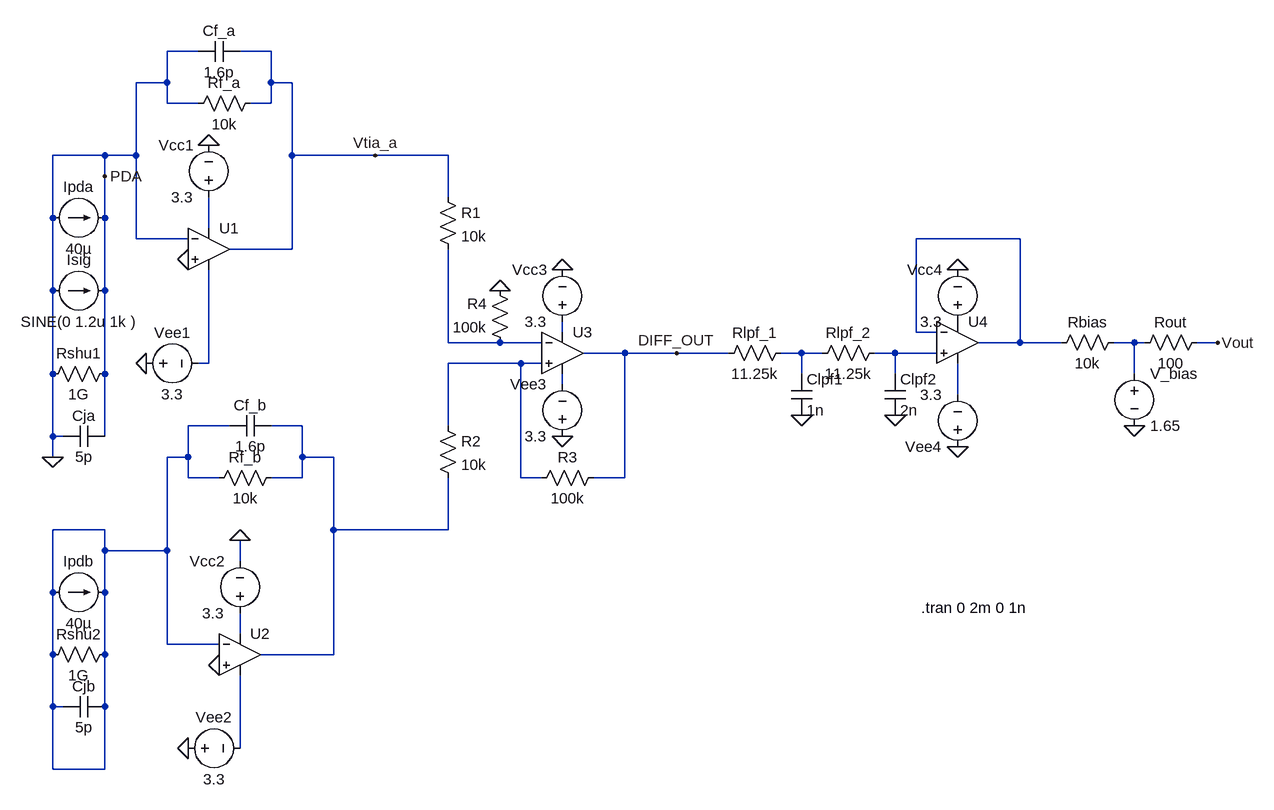
[diagram p0: schematic analog chain (1).asc]
analog chain (1).asc, the LTspice schematic file:
Version 4
SHEET 1 2132 1044
WIRE 496 -208 448 -208
WIRE 608 -208 560 -208
WIRE 448 -160 448 -208
WIRE 448 -160 400 -160
WIRE 608 -160 608 -208
WIRE 640 -160 608 -160
WIRE 448 -128 448 -160
WIRE 496 -128 448 -128
WIRE 608 -128 608 -160
WIRE 608 -128 576 -128
WIRE 352 -48 272 -48
WIRE 400 -48 400 -160
WIRE 400 -48 352 -48
WIRE 640 -48 640 -160
WIRE 768 -48 640 -48
WIRE 880 -48 768 -48
WIRE 352 -16 352 -48
WIRE 880 16 880 -48
WIRE 272 48 272 -48
WIRE 352 48 352 -16
WIRE 512 64 512 16
WIRE 400 80 400 -48
WIRE 480 80 400 80
WIRE 1760 80 1600 80
WIRE 640 96 640 -48
WIRE 640 96 544 96
WIRE 272 160 272 48
WIRE 352 160 352 48
WIRE 1056 224 1056 208
WIRE 1600 224 1600 80
WIRE 1632 224 1600 224
WIRE 880 240 880 96
WIRE 960 240 880 240
WIRE 1024 240 960 240
WIRE 1760 240 1760 80
WIRE 1760 240 1696 240
WIRE 1824 240 1760 240
WIRE 1936 240 1904 240
WIRE 1952 240 1936 240
WIRE 2064 240 2032 240
WIRE 1152 256 1088 256
WIRE 1232 256 1152 256
WIRE 1312 256 1232 256
WIRE 1424 256 1392 256
WIRE 1456 256 1424 256
WIRE 1568 256 1536 256
WIRE 1632 256 1568 256
WIRE 512 272 512 128
WIRE 512 272 496 272
WIRE 992 272 880 272
WIRE 1024 272 992 272
WIRE 272 288 272 160
WIRE 352 288 352 160
WIRE 1424 288 1424 256
WIRE 1568 288 1568 256
WIRE 1936 288 1936 240
WIRE 1056 304 1056 288
WIRE 1664 320 1664 272
WIRE 544 368 480 368
WIRE 656 368 608 368
WIRE 880 368 880 272
WIRE 272 384 272 288
WIRE 288 384 272 384
WIRE 352 384 352 288
WIRE 272 416 272 384
WIRE 480 416 480 368
WIRE 480 416 448 416
WIRE 656 416 656 368
WIRE 704 416 656 416
WIRE 480 448 480 416
WIRE 528 448 480 448
WIRE 656 448 656 416
WIRE 656 448 608 448
WIRE 992 448 992 272
WIRE 1024 448 992 448
WIRE 1152 448 1152 256
WIRE 1152 448 1104 448
WIRE 352 528 272 528
WIRE 704 528 704 416
WIRE 880 528 880 448
WIRE 880 528 704 528
WIRE 352 560 352 528
WIRE 448 560 448 416
WIRE 448 560 352 560
WIRE 560 576 560 544
WIRE 272 624 272 528
WIRE 352 624 352 560
WIRE 560 688 560 656
WIRE 448 704 448 560
WIRE 528 704 448 704
WIRE 272 720 272 624
WIRE 352 720 352 624
WIRE 704 720 704 528
WIRE 704 720 592 720
WIRE 272 800 272 720
WIRE 288 800 272 800
WIRE 352 800 352 720
WIRE 560 864 560 752
WIRE 272 896 272 800
WIRE 352 896 352 800
WIRE 352 896 272 896
FLAG 352 -16 PDA
FLAG 512 -64 0
FLAG 480 112 0
FLAG 416 272 0
FLAG 272 416 0
FLAG 480 864 0
FLAG 528 736 0
FLAG 560 544 0
FLAG 1056 384 0
FLAG 1056 128 0
FLAG 960 160 0
FLAG 1232 256 DIFF_OUT
FLAG 1424 352 0
FLAG 1568 352 0
FLAG 1664 128 0
FLAG 1664 400 0
FLAG 1936 368 0
FLAG 2064 240 Vout
FLAG 768 -48 Vtia_a
SYMBOL voltage 400 272 R270
WINDOW 0 32 56 VTop 2
WINDOW 3 -32 56 VBottom 2
SYMATTR InstName Vee1
SYMATTR Value 3.3
SYMBOL current 272 48 R270
WINDOW 0 32 40 VTop 2
WINDOW 3 -32 40 VBottom 2
SYMATTR InstName Ipda
SYMATTR Value 40µ
SYMBOL current 272 160 R270
WINDOW 0 32 40 VTop 2
WINDOW 3 -32 40 VBottom 2
SYMATTR InstName Isig
SYMATTR Value SINE(0 1.2u 1k )
SYMBOL cap 352 368 R90
WINDOW 0 0 32 VBottom 2
WINDOW 3 32 32 VTop 2
SYMATTR InstName Cja
SYMATTR Value 5p
SYMBOL res 368 272 R90
WINDOW 0 0 56 VBottom 2
WINDOW 3 32 56 VTop 2
SYMATTR InstName Rshu1
SYMATTR Value 1G
SYMBOL voltage 512 32 R180
WINDOW 0 24 96 Left 2
WINDOW 3 24 16 Left 2
SYMATTR InstName Vcc1
SYMATTR Value 3.3
SYMBOL cap 560 -224 R90
WINDOW 0 0 32 VBottom 2
WINDOW 3 32 32 VTop 2
SYMATTR InstName Cf_a
SYMATTR Value 1.6p
SYMBOL res 592 -144 R90
WINDOW 0 0 56 VBottom 2
WINDOW 3 32 56 VTop 2
SYMATTR InstName Rf_a
SYMATTR Value 10k
SYMBOL current 272 624 R270
WINDOW 0 32 40 VTop 2
WINDOW 3 -32 40 VBottom 2
SYMATTR InstName Ipdb
SYMATTR Value 40µ
SYMBOL res 368 704 R90
WINDOW 0 0 56 VBottom 2
WINDOW 3 32 56 VTop 2
SYMATTR InstName Rshu2
SYMATTR Value 1G
SYMBOL cap 352 784 R90
WINDOW 0 0 32 VBottom 2
WINDOW 3 32 32 VTop 2
SYMATTR InstName Cjb
SYMATTR Value 5p
SYMBOL voltage 464 864 R270
WINDOW 0 32 56 VTop 2
WINDOW 3 -32 56 VBottom 2
SYMATTR InstName Vee2
SYMATTR Value 3.3
SYMBOL voltage 560 672 R180
WINDOW 0 24 96 Left 2
WINDOW 3 24 16 Left 2
SYMATTR InstName Vcc2
SYMATTR Value 3.3
SYMBOL res 624 432 R90
WINDOW 0 0 56 VBottom 2
WINDOW 3 32 56 VTop 2
SYMATTR InstName Rf_b
SYMATTR Value 10k
SYMBOL cap 608 352 R90
WINDOW 0 0 32 VBottom 2
WINDOW 3 32 32 VTop 2
SYMATTR InstName Cf_b
SYMATTR Value 1.6p
SYMBOL OpAmps/UniversalOpAmp2 1056 256 R0
SYMATTR InstName U3
SYMBOL OpAmps/UniversalOpAmp2 512 96 R0
SYMATTR InstName U1
SYMBOL OpAmps/UniversalOpAmp2 560 720 R0
SYMATTR InstName U2
SYMBOL res 864 0 R0
SYMATTR InstName R1
SYMATTR Value 10k
SYMBOL res 864 352 R0
SYMATTR InstName R2
SYMATTR Value 10k
SYMBOL voltage 1056 400 R180
WINDOW 0 24 96 Left 2
WINDOW 3 24 16 Left 2
SYMATTR InstName Vee3
SYMATTR Value 3.3
SYMBOL voltage 1056 224 R180
WINDOW 0 24 96 Left 2
WINDOW 3 24 16 Left 2
SYMATTR InstName Vcc3
SYMATTR Value 3.3
SYMBOL res 1120 432 R90
WINDOW 0 0 56 VBottom 2
WINDOW 3 32 56 VTop 2
SYMATTR InstName R3
SYMATTR Value 100k
SYMBOL res 976 256 R180
WINDOW 0 36 76 Left 2
WINDOW 3 36 40 Left 2
SYMATTR InstName R4
SYMATTR Value 100k
SYMBOL OpAmps/UniversalOpAmp2 1664 240 R0
SYMATTR InstName U4
SYMBOL res 1408 240 R90
WINDOW 0 0 56 VBottom 2
WINDOW 3 32 56 VTop 2
SYMATTR InstName Rlpf_1
SYMATTR Value 11.25k
SYMBOL res 1552 240 R90
WINDOW 0 0 56 VBottom 2
WINDOW 3 32 56 VTop 2
SYMATTR InstName Rlpf_2
SYMATTR Value 11.25k
SYMBOL cap 1408 288 R0
SYMATTR InstName Clpf1
SYMATTR Value 1n
SYMBOL cap 1552 288 R0
SYMATTR InstName Clpf2
SYMATTR Value 2n
SYMBOL voltage 1664 416 R180
WINDOW 0 24 96 Left 2
WINDOW 3 24 16 Left 2
SYMATTR InstName 3.3
SYMATTR Value Vee4
SYMBOL voltage 1664 224 R180
WINDOW 0 24 96 Left 2
WINDOW 3 24 16 Left 2
SYMATTR InstName Vcc4
SYMATTR Value 3.3
SYMBOL res 1920 224 R90
WINDOW 0 0 56 VBottom 2
WINDOW 3 32 56 VTop 2
SYMATTR InstName Rbias
SYMATTR Value 10k
SYMBOL res 2048 224 R90
WINDOW 0 0 56 VBottom 2
WINDOW 3 32 56 VTop 2
SYMATTR InstName Rout
SYMATTR Value 100
SYMBOL voltage 1936 272 R0
SYMATTR InstName V_bias
SYMATTR Value 1.65
TEXT 1608 648 Left 2 !.tran 0 2m 0 1n

The netlist it stands for:
* analog chain (1).asc
Vee1 0 N008 3.3
Ipda 0 0 40µ
Isig 0 0 SINE(0 1.2u 1k )
Cja 0 0 5p
Rshu1 0 0 1G
Vcc1 N001 0 3.3
Cf_a Vtia_a 0 1.6p
Rf_a Vtia_a 0 10k
Ipdb N012 N012 40µ
Rshu2 N012 N012 1G
Cjb N012 N012 5p
Vee2 0 N015 3.3
Vcc2 N014 0 3.3
Rf_b N013 N012 10k
Cf_b N013 N012 1.6p
XU3 N009 N004 N003 N010 DIFF_OUT level2 Avol=1Meg GBW=10Meg Slew=10Meg Ilimit=25m Rail=0 Vos=0 En=0 Enk=0 In=0 Ink=0 Rin=500Meg  ; pins In+ In- V+ V- OUT
XU1 0 0 N001 N008 Vtia_a level2 Avol=1Meg GBW=10Meg Slew=10Meg Ilimit=25m Rail=0 Vos=0 En=0 Enk=0 In=0 Ink=0 Rin=500Meg  ; pins In+ In- V+ V- OUT
XU2 0 N012 N014 N015 N013 level2 Avol=1Meg GBW=10Meg Slew=10Meg Ilimit=25m Rail=0 Vos=0 En=0 Enk=0 In=0 Ink=0 Rin=500Meg  ; pins In+ In- V+ V- OUT
R1 Vtia_a N004 10k
R2 N009 N013 10k
Vee3 0 N010 3.3
Vcc3 N003 0 3.3
R3 DIFF_OUT N009 100k
R4 N004 0 100k
XU4 N007 N002 P001 N011 N002 level2 Avol=1Meg GBW=10Meg Slew=10Meg Ilimit=25m Rail=0 Vos=0 En=0 Enk=0 In=0 Ink=0 Rin=500Meg  ; pins In+ In- V+ V- OUT
Rlpf_1 N006 DIFF_OUT 11.25k
Rlpf_2 N007 N006 11.25k
Clpf1 N006 0 1n
Clpf2 N007 0 2n
V§3.3 0 N011 Vee4
Vcc4 P001 0 3.3
Rbias N005 N002 10k
Rout Vout N005 100
V_bias N005 0 1.65
.tran 0 2m 0 1n
.lib UniversalOpAmp2.lib
.backanno
.end